# EasyEDA Pro project NFC Card.epro

# Schematic Schematic1
Board Name: Board1; Create Date: 2026-01-01; Page Name: P1; Project Name: NFC Card; Schematic Name: Schematic1; Update Date: 2026-01-01; Company: EasyEDA.com; Page Size: A4; Version: V1.0
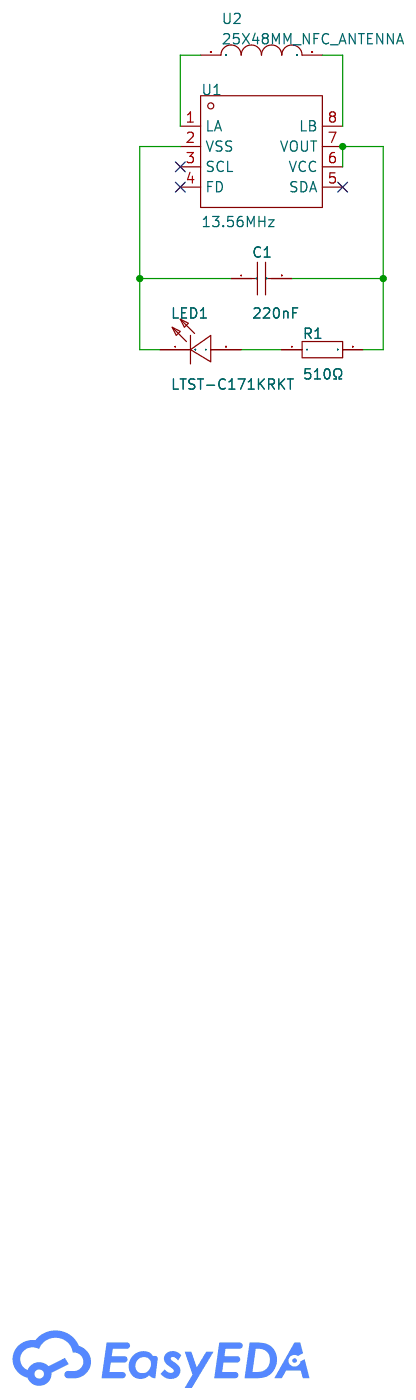
[diagram p0: schematic sheet]

## Parts
C1  220nF  [C0603]
LED1  LTST-C171KRKT  [LED-SMD_L2.0-W1.25-RD_RED]
R1  510Ω  [R0402]
U1  13.56MHz  [XQFN-8_L1.6-W1.6-P0.50-BL_NT3H2111W0FHKH]
U2  25X48MM_NFC_ANTENNA  [25X48MM_NFC_ANTENNA]

## Library data of the parts
C1 = CL10B224KA8NNNC: 容值:220nF;精度:±10%;额定电压:25V;材质(温度系数):X7R;; LCSC Part Name: 220nF ±10% 25V; Supplier Part: C21120; Manufacturer: SAMSUNG(三星); Supplier Footprint: 0603; JLCPCB Part Class: Basic Part; Datasheet: https://atta.szlcsc.com/upload/public/pdf/source/20160103/1457707705031.pdf; Supplier: LCSC; Tolerance: ±10%; Voltage Rated: 25V; Temperature Coefficient: X7R
LED1 = LTST-C171KRKT: Emitted Color:Red Forward Voltage (VF):2V Forward Voltage (VF):2V Power Dissipation:75mW Forward Current:20mA Dominant Wavelength:631nm Dominant Wavelength:631nm Peak Wavelength:639nm Diode Configuration:- Lens Color:无色透明透镜 Color Temperature:- Color Tempe; LCSC Part Name: 红灯; Supplier Part: C284871; Manufacturer: LITEON(光宝); Supplier Footprint: 0805; JLCPCB Part Class: Extended Part; Datasheet: https://atta.szlcsc.com/upload/public/pdf/source/20181016/C284871_ED9ED1A35B56D9B6D167875BC11D880E.pdf; Supplier: LCSC; Emitted Color: Red; Forward Voltage (VF): 2V; Power Dissipation: 75mW; Forward Current: 20mA; Dominant Wavelength: 631nm; Peak Wavelength: 639nm; Lens Color: 无色透明透镜; Luminous Intensity: 54mcd; Viewing Angle: 130°; Operating Temperature: -55℃~+85℃
R1 = RC0402FR-07510RL: Type:Thick Film Resistors Resistance: Tolerance:±1% Tolerance:±1% Power(Watts): Overload Voltage (Max): Temperature Coefficient:±100ppm/℃ Temperature Coefficient:±100ppm/℃ Operating Temperature Range:-55℃~+155℃ Operating Temperature Range:-55℃~+155℃; LCSC Part Name: 厚膜电阻 510Ω ±1% 62.5mW; Supplier Part: C276273; Manufacturer: YAGEO(国巨); Supplier Footprint: 0402; JLCPCB Part Class: Extended Part; Datasheet: https://atta.szlcsc.com/upload/public/pdf/source/20180904/C276339_014E484F1DBA106FB92D45EABD5A1AC1.pdf; Supplier: LCSC; Type: Thick Film Resistors; Tolerance: ±1%; Temperature Coefficient: ±100ppm/℃; Operating Temperature Range: -55℃~+155℃
U1 = NT3H2111W0FHKH: agreement:ISO 14443 interface type:I2C Frequency:13.56MHz Frequency:13.56MHz mains input:3.3V mains input:3.3V; Supplier Part: C710403; Manufacturer: NXP(恩智浦); Supplier Footprint: XQFN-8(1.6x1.6); JLCPCB Part Class: Extended Part; Datasheet: https://www.nxp.com/docs/en/data-sheet/NT3H2111_2211.pdf; Supplier: LCSC; agreement: ISO 14443; interface type: I2C; mains input: 3.3V
U2 = 25X48MM_NFC_ANTENNA

## Nets
$1N430: U1.8(LB) U2.P$2
$1N435: U1.1(LA) U2.P$1
$1N518: C1.2 R1.2 U1.6(VCC) U1.7(VOUT)
$1N545: LED1.2(A) R1.1
$1N550: C1.1 LED1.1(C) U1.2(VSS)

Not connected (* = marked no-connect by the designer): U1 3(SCL)* 4(FD)* 5(SDA)*

# Board PCB1
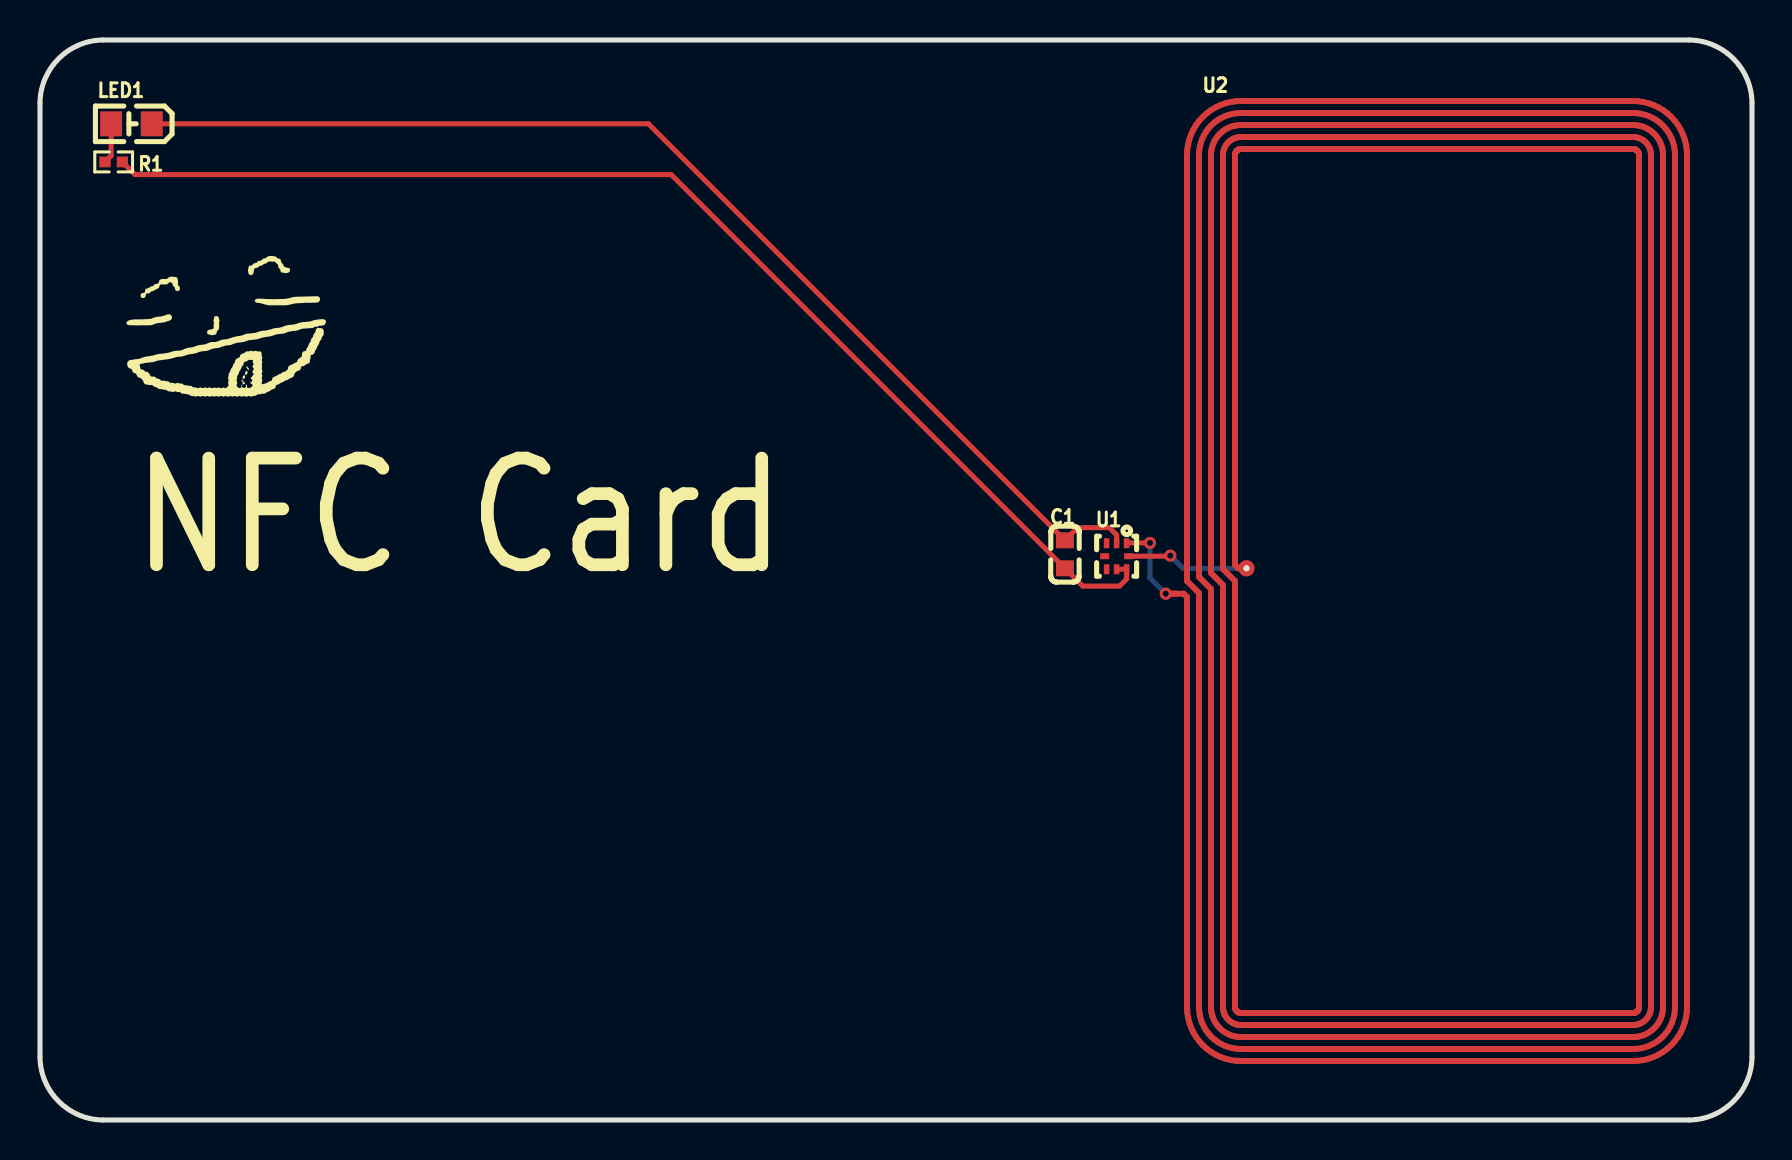
[diagram p1: board, top side]
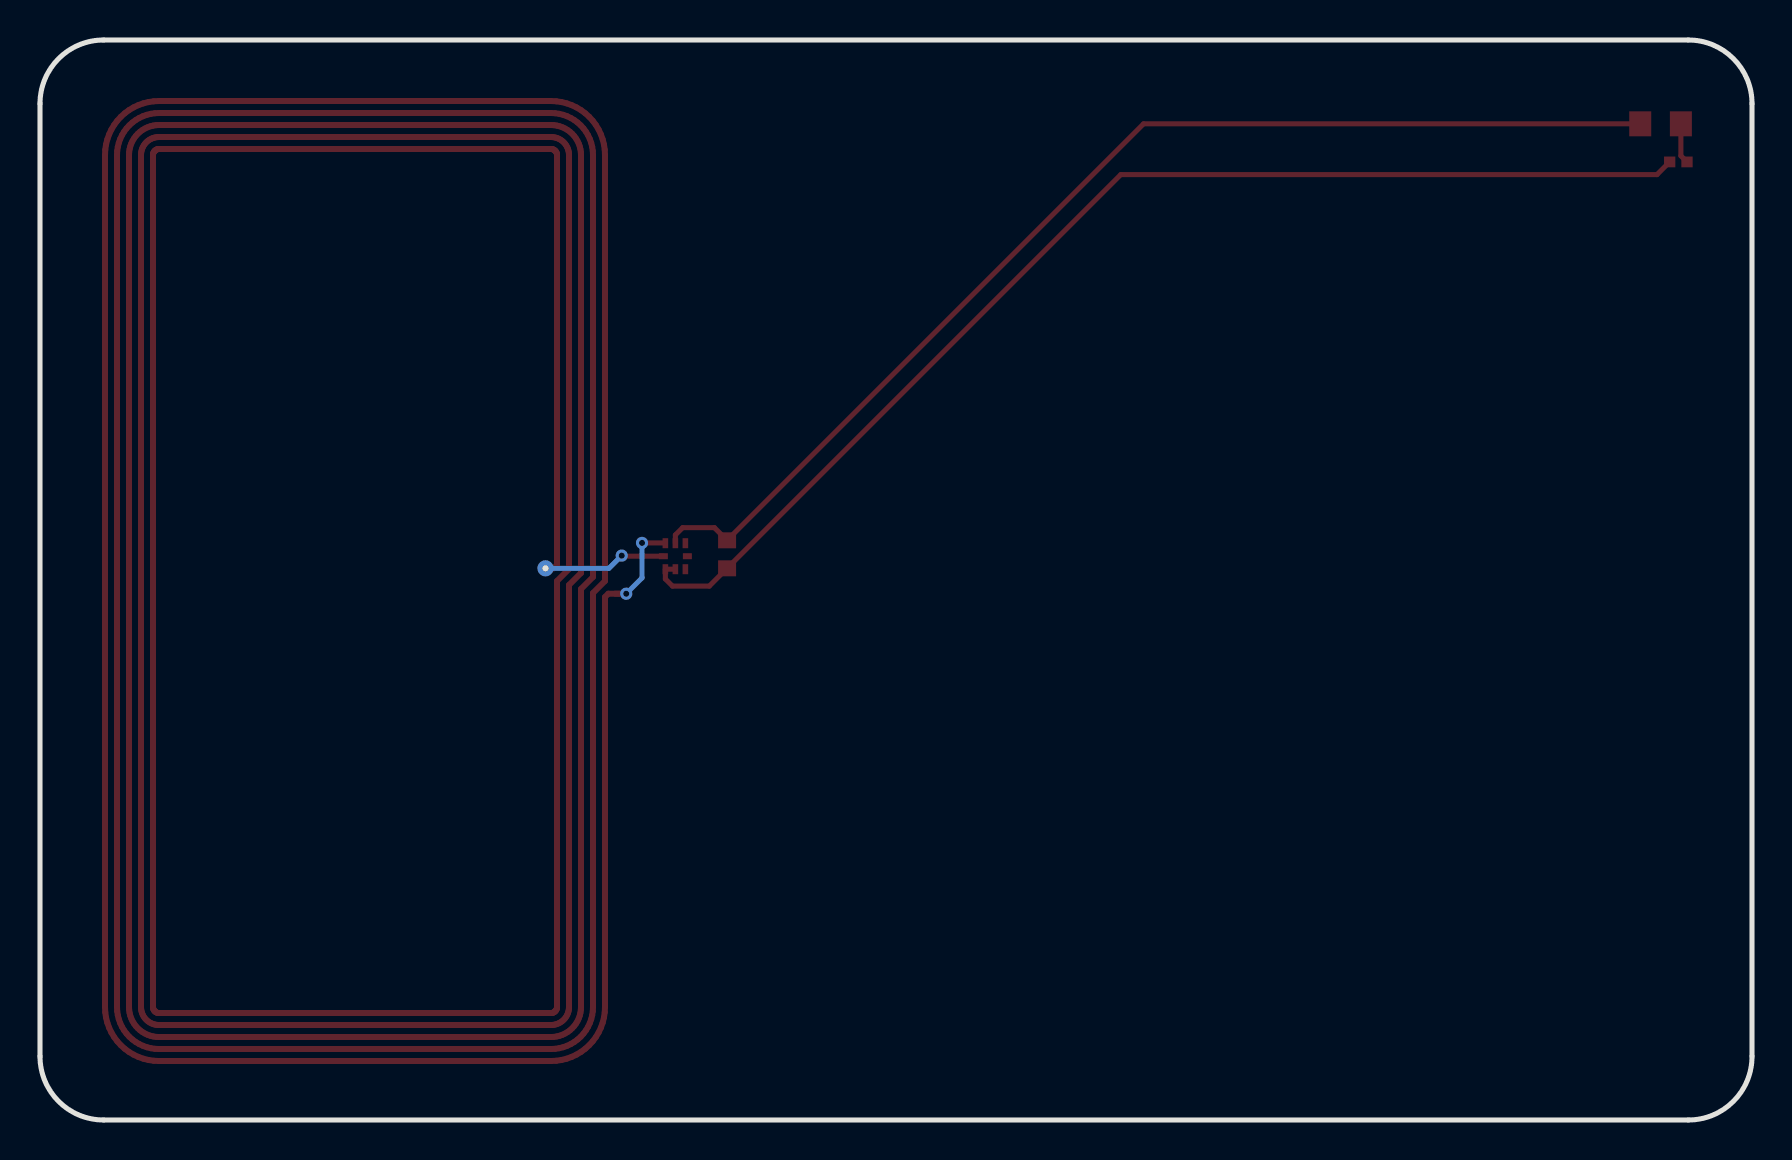
[diagram p2: board, bottom side, seen from below]

Outline 85.6 x 54 mm; copper layers: Top Layer, Bottom Layer. Coordinates in mm from the lower left corner of the outline.
Outline path: 0,50.82 0,3.18 arc(0.93,0.93) 3.18,0 82.42,0 arc(84.67,0.93) 85.6,3.18 85.6,50.82 arc(84.67,53.07) 82.42,54 3.18,54 arc(0.93,53.07) 0,50.82
Stack: Top Layer 0.035mm / Dielectric1 1.51mm FR4 er 4.5 / Bottom Layer 0.035mm

## Design rules (mm)
template: JLCPCB Capability(Two Layers Board)
spacing copperThickness1oz (default): track to track 0.102, other pairs 0.152 to 0.3
spacing copperThickness2oz: track to track 0.203, other pairs 0.152 to 0.3
track width copperThickness1oz (default): min 0.127, default 0.254, max 2.54
track width copperThickness2oz: min 0.203, default 0.254, max 2.54
differential pair differentialPair (default): width min 0.127, default 0.254, max 2.54; gap min 0.152, default 0.152
via viaSize (default): diameter min 0.5, default 0.61, max 10; hole min 0.3, default 0.305, max 6.3

## Placement (name value [footprint] x y rotation side)
C1  220nF  [C0603]  51.25 28.28 270 top
LED1  LTST-C171KRKT  [LED-SMD_L2.0-W1.25-RD_RED]  4.57 49.81 180 top
R1  510Ω  [R0402]  3.68 47.9 0 top
U1  13.56MHz  [XQFN-8_L1.6-W1.6-P0.50-BL_NT3H2111W0FHKH]  53.83 28.19 180 top
U2  -  [25X48MM_NFC_ANTENNA]  69.85 26.95 90 top

## Footprints (pads in the part's own frame, mm; a bottom-side part is the same pattern mirrored in y, then rotated)
25X48MM_NFC_ANTENNA
  rect 0.3x0.75 smd: P$1(-0.635,13.335)
  round 0.808 hole 0.3: P$2(0.635,9.525)
C0603
  rect 0.8x0.9 smd: 1(-0.7,0) 2(0.7,0)
LED-SMD_L2.0-W1.25-RD_RED
  rect 1.1x1.25 smd: 1(-1.016,0) 2(1.016,0)
R0402
  rect 0.566x0.54 smd: 1(-0.433,0) 2(0.433,0)
XQFN-8_L1.6-W1.6-P0.50-BL_NT3H2111W0FHKH
  rect 0.28x0.5 smd: 1(-0.5,-0.65) 2(0,-0.65) 3(0.5,-0.65) 5(0.5,0.65) 6(0,0.65) 7(-0.5,0.65)
  rect 0.45x0.3 smd: 4(0.6,0) 8(-0.6,0)

## Nets
As in the schematic.

Pads without a net: U1 3 4 5

## Via types
v1: diameter 0.61, hole 0.305, Top Layer to Bottom Layer, 3 vias

## Routing (per net, layer and track width the routed paths; a pad name or vN(x,y) marks a point on that pad's centre or on a via; arc(x,y) is an arc through that point)
$1N430: length 6.2
  Top Layer w0.254: U1.8 56.48,28.19 v1(56.52,28.22)
  Bottom Layer w0.254: v1(56.52,28.22) 57.15,27.58 U2.P$2
$1N435: length 4
  Top Layer w0.254: U1.1 54.35,28.85 v1(55.5,28.85)
  Bottom Layer w0.254: v1(56.29,26.31) 55.5,27.1 v1(55.5,28.85)
$1N518: length 60.1
  Top Layer w0.254: 53.83,27.54 54.33,27.54 54.33,27.05 53.98,26.69 52.14,26.69 C1.2 31.56,47.27 4.75,47.27 R1.2
$1N545: length 2
  Top Layer w0.254: R1.1 3.56,48.21 LED1.2
$1N550: length 57.7
  Top Layer w0.254: LED1.1 30.42,49.81 C1.1 51.88,29.62 53.47,29.62 53.83,29.25 U1.2

## Text on the board
Top Silkscreen Layer: NFC Card
